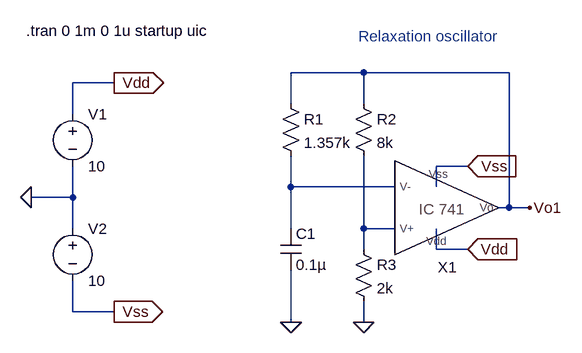
[diagram p0: schematic relaxation oscillator.asc]
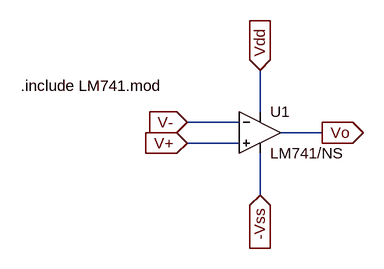
[diagram p1: sub-circuit ic741.asc]
relaxation oscillator.asc, the LTspice schematic file:
Version 4
SHEET 1 1764 1108
WIRE 96 -32 -16 -32
WIRE 320 -32 96 -32
WIRE -288 -16 -352 -16
WIRE -16 16 -16 -32
WIRE 96 16 96 -32
WIRE -352 32 -352 -16
WIRE 256 112 208 112
WIRE -16 144 -16 96
WIRE 144 144 -16 144
WIRE 208 144 208 112
WIRE -352 160 -352 112
WIRE -352 160 -416 160
WIRE 320 176 320 -32
WIRE 320 176 304 176
WIRE 352 176 320 176
WIRE -352 208 -352 160
WIRE -16 208 -16 144
WIRE 96 208 96 96
WIRE 144 208 96 208
WIRE 96 240 96 208
WIRE 208 240 208 208
WIRE 256 240 208 240
WIRE -352 336 -352 288
WIRE -288 336 -352 336
WIRE -16 352 -16 272
WIRE 96 352 96 320
FLAG -416 160 0
FLAG -288 -16 Vdd
IOPIN -288 -16 Out
FLAG -288 336 Vss
IOPIN -288 336 Out
FLAG 256 112 Vss
IOPIN 256 112 In
FLAG 256 240 Vdd
IOPIN 256 240 In
FLAG 352 176 Vo1
FLAG -16 352 0
FLAG 96 352 0
SYMBOL IC741 224 160 M180
SYMATTR InstName X1
SYMBOL voltage -352 16 R0
WINDOW 123 0 0 Left 0
WINDOW 39 0 0 Left 0
SYMATTR InstName V1
SYMATTR Value 10
SYMBOL voltage -352 192 R0
WINDOW 123 0 0 Left 0
WINDOW 39 0 0 Left 0
SYMATTR InstName V2
SYMATTR Value 10
SYMBOL res -32 0 R0
SYMATTR InstName R1
SYMATTR Value 1.357k
SYMBOL res 80 0 R0
SYMATTR InstName R2
SYMATTR Value 8k
SYMBOL cap -32 208 R0
SYMATTR InstName C1
SYMATTR Value 0.1µ
SYMBOL res 80 224 R0
SYMATTR InstName R3
SYMATTR Value 2k
TEXT 88 -88 Left 2 ;Relaxation oscillator
TEXT -424 -96 Left 2 !.tran 0 1m 0 1u startup uic

ic741.asc, the sub-circuit schematic file:
Version 4
SHEET 1 880 680
WIRE 368 128 368 64
WIRE 336 144 256 144
WIRE 464 160 400 160
WIRE 336 176 256 176
WIRE 368 256 368 192
FLAG 464 160 Vo
IOPIN 464 160 Out
FLAG 368 64 Vdd
IOPIN 368 64 In
FLAG 368 256 -Vss
IOPIN 368 256 In
FLAG 256 176 V+
IOPIN 256 176 In
FLAG 256 144 V-
IOPIN 256 144 In
SYMBOL OpAmps\\opamp2 368 96 R0
SYMATTR InstName U1
SYMATTR Value LM741/NS
TEXT 0 88 Left 2 !.include LM741.mod

The netlist it stands for:
* relaxation oscillator.asc
XX1 Vss N002 N001 Vdd Vo1 ic741
V1 Vdd 0 10
V2 0 Vss 10
R1 Vo1 N001 1.357k
R2 Vo1 N002 8k
C1 N001 0 0.1µ
R3 N002 0 2k

* block symbol definitions
.subckt ic741 -Vss V+ V- Vdd Vo
XU1 V+ V- Vdd -Vss Vo LM741/NS  ; pins In+ In- V+ V- OUT
.include LM741.mod
.ends ic741

* Relaxation oscillator
.tran 0 1m 0 1u startup uic
.backanno
.end